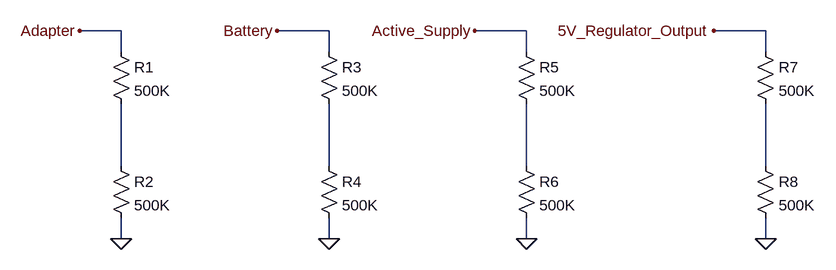
[diagram p0: schematic Sensors.asc]
Sensors.asc, the LTspice schematic file:
Version 4
SHEET 1 880 680
WIRE -240 176 -304 176
WIRE 80 176 0 176
WIRE 384 176 304 176
WIRE 752 176 672 176
WIRE -240 208 -240 176
WIRE 80 208 80 176
WIRE 384 208 384 176
WIRE 752 208 752 176
WIRE -240 384 -240 288
WIRE 80 384 80 288
WIRE 384 384 384 288
WIRE 752 384 752 288
WIRE -240 496 -240 464
WIRE 80 496 80 464
WIRE 384 496 384 464
WIRE 752 496 752 464
FLAG 304 176 Active_Supply
FLAG 0 176 Battery
FLAG -304 176 Adapter
FLAG 672 176 5V_Regulator_Output
FLAG -240 496 0
FLAG 80 496 0
FLAG 384 496 0
FLAG 752 496 0
SYMBOL res -256 192 R0
SYMATTR InstName R1
SYMATTR Value 500K
SYMBOL res -256 368 R0
SYMATTR InstName R2
SYMATTR Value 500K
SYMBOL res 64 192 R0
SYMATTR InstName R3
SYMATTR Value 500K
SYMBOL res 64 368 R0
SYMATTR InstName R4
SYMATTR Value 500K
SYMBOL res 368 192 R0
SYMATTR InstName R5
SYMATTR Value 500K
SYMBOL res 368 368 R0
SYMATTR InstName R6
SYMATTR Value 500K
SYMBOL res 736 192 R0
SYMATTR InstName R7
SYMATTR Value 500K
SYMBOL res 736 368 R0
SYMATTR InstName R8
SYMATTR Value 500K

The netlist it stands for:
* Sensors.asc
R1 Adapter N001 500K
R2 N001 0 500K
R3 Battery N002 500K
R4 N002 0 500K
R5 Active_Supply N003 500K
R6 N003 0 500K
R7 5V_Regulator_Output N004 500K
R8 N004 0 500K
.backanno
.end